# EAGLE board SmartCellPrototype (EAGLE 7.1.0), part 1 of 2
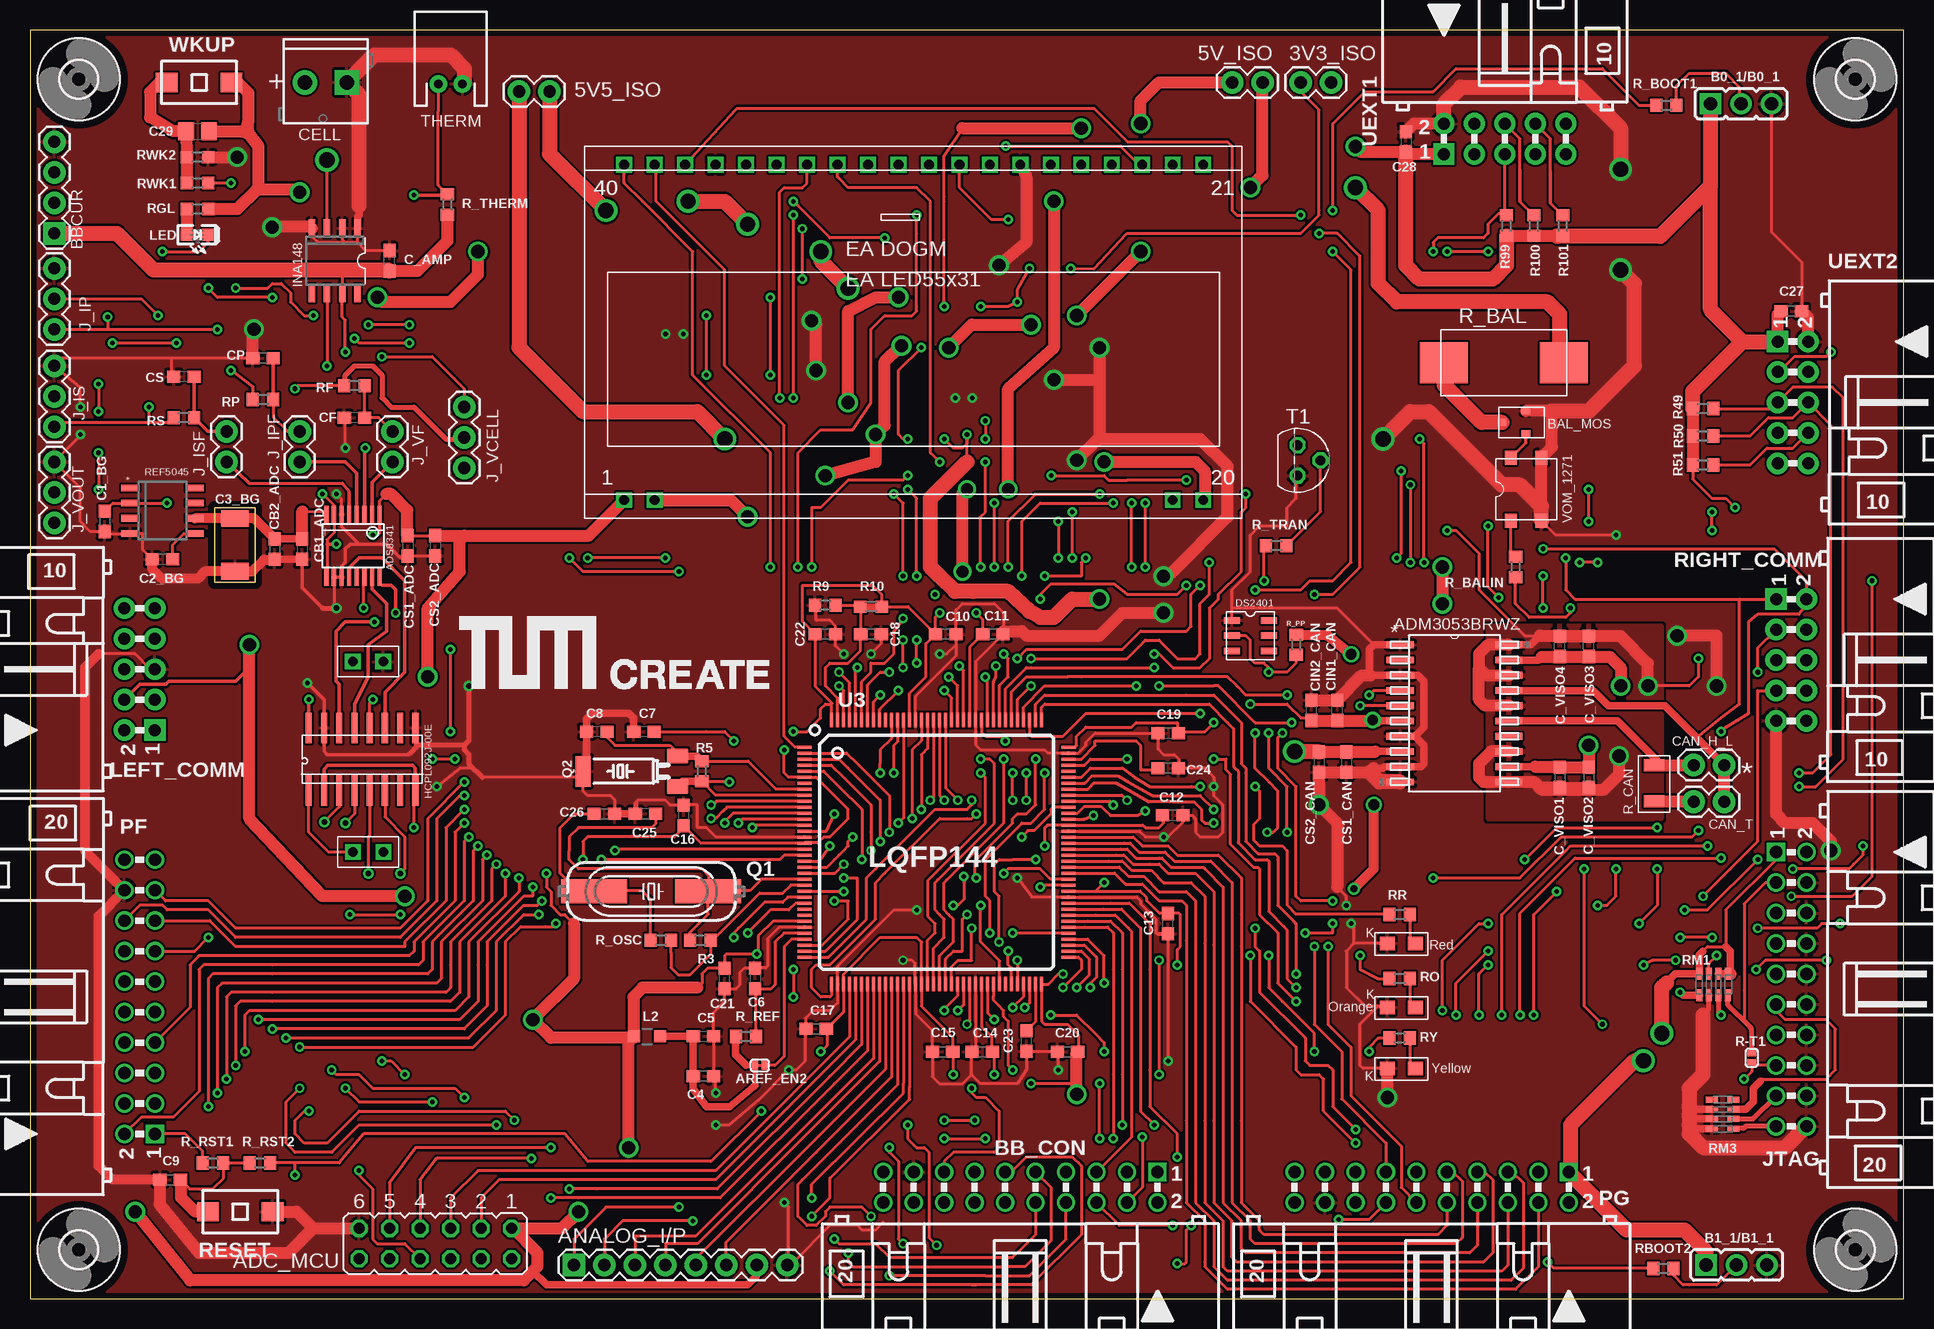
[diagram p5: board, top side]
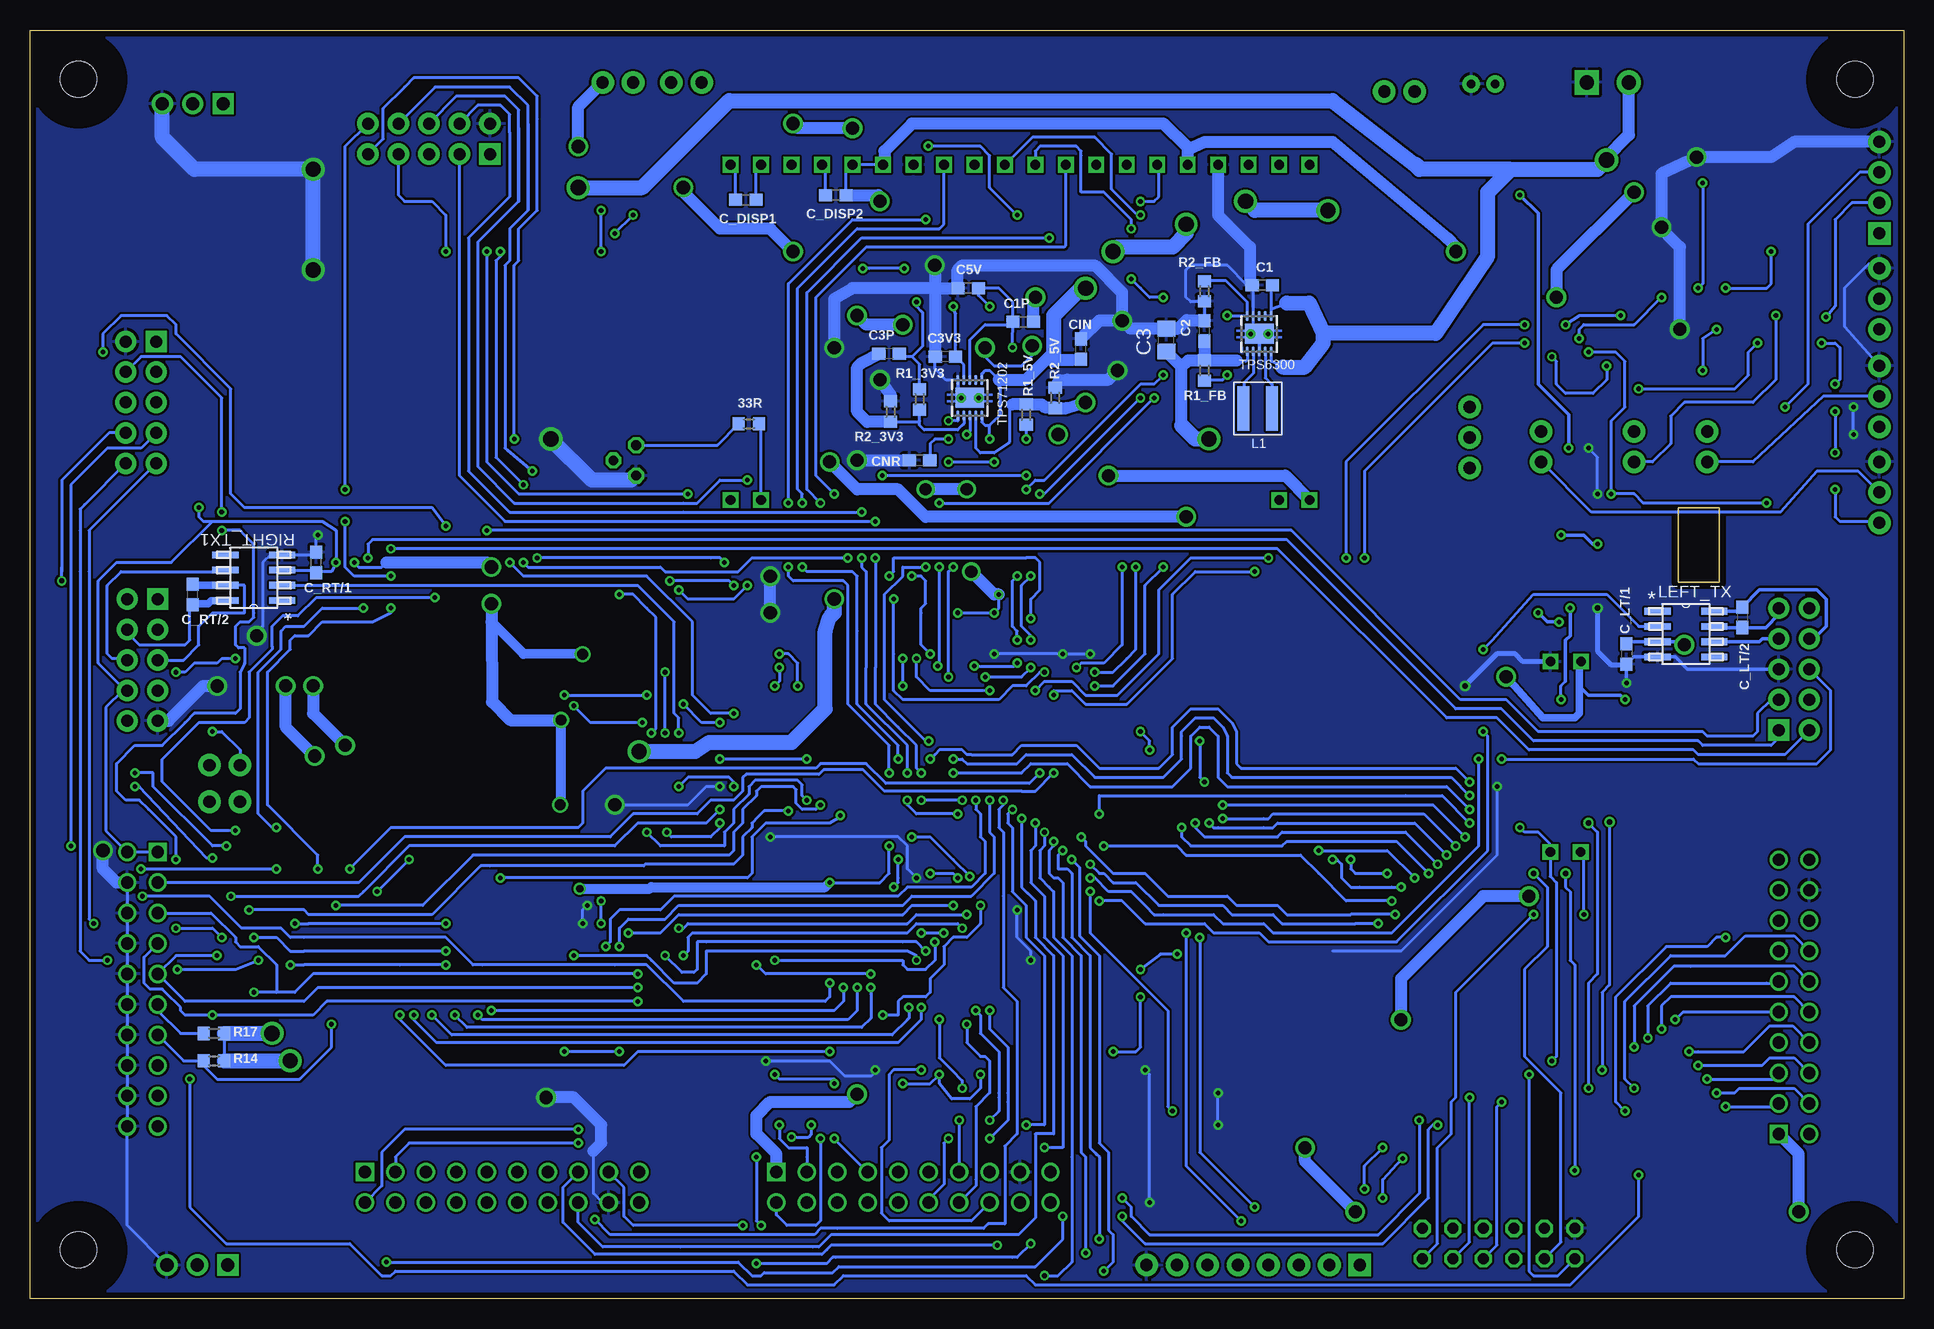
[diagram p6: board, bottom side, seen from below]

Size 156.19 x 105.72 mm. Coordinates in mm from the lower left corner, seen from the top.
Outline: 0,0 156.19,0 156.19,105.72 0,105.72 0,0
Copper layers (1*16): Top 0.0356mm / dielectric 1.5011mm / Bottom 0.0356mm
Design rules "SilverCircuits": minimum track width 7mil, minimum drill 14mil, track to track 7mil, track to pad 7mil, pad to pad 7mil, via to via 7mil, smd to smd 0mil, copper to edge 20mil, drill to drill 8mil, minimum pad ring 10mil, minimum via ring 8mil, stop-mask expansion 4mil, vias tented up to drill 0mil, thermal gap 10mil
Net classes: 2 thin: width 0.025 mm, clearance 0.025 mm

## Footprints (pad centres in the part's own frame; a part is rotated, then mirrored left to right if it is on the bottom)
1X02 = drill 1.016 pad 1.88: 1 0,0; 2 2.54,0
JP6Q = drill 0.914 octagon: 1 -6.35,-1.27; 2 -6.35,1.27; 3 -3.81,-1.27; 4 -3.81,1.27; 5 -1.27,-1.27; 6 -1.27,1.27; 7 1.27,-1.27; 8 1.27,1.27; 9 3.81,-1.27; 10 3.81,1.27; 11 6.35,-1.27; 12 6.35,1.27
1X08 = drill 1.016 pad 1.88 square: 1 0,0 | drill 1.016 pad 1.88: 2 2.54,0; 3 5.08,0; 4 7.62,0; 5 10.16,0; 6 12.7,0; 7 15.24,0; 8 17.78,0
SJ_1_SMALLER_CLOSE = smd 0.508 x 0.762: 1 -0.381,0; 2 0.381,0
JP2 = drill 1.1 pad 1.778 square: 1 -2.54,0 | drill 1.1 pad 1.778: 2 0,0; 3 2.54,0
BAL_MOS = smd 0.56 x 0.73: D 0,0.99; G -0.95,-0.99; S 0.95,-0.99
BH20R = drill 1.016 square: 1 -11.43,-1.27 | drill 1.016: 2 -11.43,1.27; 3 -8.89,-1.27; 4 -8.89,1.27; 5 -6.35,-1.27; 6 -6.35,1.27; 7 -3.81,-1.27; 8 -3.81,1.27; 9 -1.27,-1.27; 10 -1.27,1.27; 11 1.27,-1.27; 12 1.27,1.27; 13 3.81,-1.27; 14 3.81,1.27; 15 6.35,-1.27; 16 6.35,1.27; 17 8.89,-1.27; 18 8.89,1.27; 19 11.43,-1.27; 20 11.43,1.27
1X04 = drill 1.016 pad 1.88 square: 1 0,0 | drill 1.016 pad 1.88: 2 2.54,0; 3 5.08,0; 4 7.62,0
C0603 = smd 1.1 x 1: 1 -0.85,0; 2 0.85,0
C0805 = smd 1.3 x 1.5: 1 -0.95,0; 2 0.95,0
C3_BG = smd 1.4 x 2.3: + -2.2,0; - 2.2,0
SCREWTERMINAL-3.5MM-2 = drill 1.2 pad 2.032 square: 1 0,0 | drill 1.2 pad 2.032: 2 3.5,0
DS2401 = smd 1.33 x 0.53: DATA -1.525,0; GND -1.525,1.27; NC1 -1.525,-1.27; NC2 1.525,-1.27; NC3 1.525,0; NC4 1.525,1.27
3,0 = hole 3: 0,0
HCPL902 = smd 0.508 x 2.54: G1 3.18,2.6; G2 3.18,-2.6; G11 -4.44,2.6; G22 -4.44,-2.6; IN1 1.91,2.6; IN2 0.63,2.6; IN3 -0.64,2.6; IN4 -1.9,-2.6; N1 -3.17,2.6; N2 -3.17,-2.6; OUT1 1.91,-2.6; OUT2 0.63,-2.6; OUT3 -0.64,-2.6; OUT4 -1.9,2.6; V1 4.45,2.6; V2 4.45,-2.6
DRC-S-PVSON-N10 = smd 0.28 x 0.85: 1 -1,-1.475; 2 -0.5,-1.475; 3 0,-1.475; 4 0.5,-1.475; 5 1,-1.475; 6 1,1.475; 7 0.5,1.475; 8 0,1.475; 9 -0.5,1.475; 10 -1,1.475 | smd 2.4 x 1.65: TH 0,0
INA148 = smd 0.55 x 1.5: +IN 0.635,-2.7; -IN -0.635,-2.7; NC -1.905,2.7; NC1 1.905,2.7; REF -1.905,-2.7; V+ -0.635,2.7; V- 1.905,-2.7; VOUT 0.635,2.7
1X03 = drill 1.016 pad 1.88: 1 0,0; 2 2.54,0; 3 5.08,0
IND_COILCRAFT3.3UH = smd 1 x 3.7: L1 -1.19,0; L2 1.19,0
FERRITE_BEAD = smd 1 x 1: 1 -1.1,0; 2 1.1,0
EA_EA_DOGM = drill 0.813 square: 1 0,0; 2 2.54,0; 19 45.72,0; 20 48.26,0; 21 48.26,27.94; 22 45.72,27.94; 23 43.18,27.94; 24 40.64,27.94; 25 38.1,27.94; 26 35.56,27.94; 27 33.02,27.94; 28 30.48,27.94; 29 27.94,27.94; 30 25.4,27.94; 31 22.86,27.94; 32 20.32,27.94; 33 17.78,27.94; 34 15.24,27.94; 35 12.7,27.94; 36 10.16,27.94; 37 7.62,27.94; 38 5.08,27.94; 39 2.54,27.94; 40 0,27.94
LED-0603 = smd 1.016 x 1.016: A 0.889,0; C -0.889,0
EA_EA_LED55X31 = drill 0.813 square: 1 0,0; 2 2.54,0; 19 45.72,0; 20 48.26,0; 21 48.26,27.94; 22 45.72,27.94; 23 43.18,27.94; 24 40.64,27.94; 25 38.1,27.94; 26 35.56,27.94; 27 33.02,27.94; 28 30.48,27.94; 29 27.94,27.94; 30 25.4,27.94; 31 22.86,27.94; 32 20.32,27.94; 33 17.78,27.94; 34 15.24,27.94; 35 12.7,27.94; 36 10.16,27.94; 37 7.62,27.94; 38 5.08,27.94; 39 2.54,27.94; 40 0,27.94
BH10R = drill 1 pad 1.778 square: 1 -5.08,-1.27 | drill 1 pad 1.778: 2 -5.08,1.27; 3 -2.54,-1.27; 4 -2.54,1.27; 5 0,-1.27; 6 0,1.27; 7 2.54,-1.27; 8 2.54,1.27; 9 5.08,-1.27; 10 5.08,1.27
R_8 = smd 2.184 x 0.559: 1 -2.362,1.905; 2 -2.362,0.635; 3 -2.362,-0.635; 4 -2.362,-1.905; 5 2.362,-1.905; 6 2.362,-0.635; 7 2.362,0.635; 8 2.362,1.905
HC49/SMD2 = smd 5.5 x 2: 1 -4.75,0; 2 4.75,0
TC26H_3_REPAIR_SMD = smd 1.27 x 1.778: 1 -1.27,0; 2 1.27,0 | smd 2.54 x 1.27: GND 0,7.874
R0603 = smd 1 x 1.1: 1 -0.85,0; 2 0.85,0
0603_0R = smd 1.016 x 1.016: 1 -0.889,0; 2 0.889,0
SJ_1_SMALLER = smd 0.508 x 0.762: 1 -0.381,0; 2 0.381,0
R_BAL = smd 4 x 3.4: 1 -5,0; 2 5,0
120OHM = smd 1 x 1.7: 1 -1.5,0; 2 1.5,0
WS-TAKT_6X3.5_SMD_NOCREAM = smd 1.6 x 1.8: P$1 0,2.7; P$2 0,-2.7
R0603_5MIL_DWS = smd 1.016 x 1.016: 1 -0.889,0; 2 0.889,0
R_MATRIX_4 = smd 1 x 0.5: 1.1 -0.9,1.2; 1.2 0.9,1.2; 2.1 -0.9,0.4; 2.2 0.9,0.4; 3.1 -0.9,-0.4; 3.2 0.9,-0.4; 4.1 -0.9,-1.2; 4.2 0.9,-1.2
TRANSISTOR-NPN_TO92 = drill 0.813 octagon: 1 1.27,0; 2 0,1.905; 3 -1.27,0
JST-2-PTH = drill 0.7 pad 1.448: 1 -1,0; 2 1,0
RW_20 = smd 2.286 x 0.559: 1 -4.528,5.715; 2 -4.528,4.445; 3 -4.528,3.175; 4 -4.528,1.905; 5 -4.528,0.635; 6 -4.528,-0.635; 7 -4.528,-1.905; 8 -4.528,-3.175; 9 -4.528,-4.445; 10 -4.528,-5.715; 11 4.528,-5.715; 12 4.528,-4.445; 13 4.528,-3.175; 14 4.528,-1.905; 15 4.528,-0.635; 16 4.528,0.635; 17 4.528,1.905; 18 4.528,3.175; 19 4.528,4.445; 20 4.528,5.715
LQFP144 = smd 1.2 x 0.254: 1 -11,8.75; 2 -11,8.25; 3 -11,7.75; 4 -11,7.25; 5 -11,6.75; 6 -11,6.25; 7 -11,5.75; 8 -11,5.25; 9 -11,4.75; 10 -11,4.25; 11 -11,3.75; 12 -11,3.25; 13 -11,2.75; 14 -11,2.25; 15 -11,1.75; 16 -11,1.25; 17 -11,0.75; 18 -11,0.25; 19 -11,-0.25; 20 -11,-0.75; 21 -11,-1.25; 22 -11,-1.75; 23 -11,-2.25; 24 -11,-2.75; 25 -11,-3.25; 26 -11,-3.75; 27 -11,-4.25; 28 -11,-4.75; 29 -11,-5.25; 30 -11,-5.75; 31 -11,-6.25; 32 -11,-6.75; 33 -11,-7.25; 34 -11,-7.75; 35 -11,-8.25; 36 -11,-8.75; 73 11,-8.75; 74 11,-8.25; 75 11,-7.75; 76 11,-7.25; 77 11,-6.75; 78 11,-6.25; 79 11,-5.75; 80 11,-5.25; 81 11,-4.75; 82 11,-4.25; 83 11,-3.75; 84 11,-3.25; 85 11,-2.75; 86 11,-2.25; 87 11,-1.75; 88 11,-1.25; 89 11,-0.75; 90 11,-0.25; 91 11,0.25; 92 11,0.75; 93 11,1.25; 94 11,1.75; 95 11,2.25; 96 11,2.75; 97 11,3.25; 98 11,3.75; 99 11,4.25; 100 11,4.75; 101 11,5.25; 102 11,5.75; 103 11,6.25; 104 11,6.75; 105 11,7.25; 106 11,7.75; 107 11,8.25; 108 11,8.75 | smd 0.254 x 1.2: 37 -8.75,-11; 38 -8.25,-11; 39 -7.75,-11; 40 -7.25,-11; 41 -6.75,-11; 42 -6.25,-11; 43 -5.75,-11; 44 -5.25,-11; 45 -4.75,-11; 46 -4.25,-11; 47 -3.75,-11; 48 -3.25,-11; 49 -2.75,-11; 50 -2.25,-11; 51 -1.75,-11; 52 -1.25,-11; 53 -0.75,-11; 54 -0.25,-11; 55 0.25,-11; 56 0.75,-11; 57 1.25,-11; 58 1.75,-11; 59 2.25,-11; 60 2.75,-11; 61 3.25,-11; 62 3.75,-11; 63 4.25,-11; 64 4.75,-11; 65 5.25,-11; 66 5.75,-11; 67 6.25,-11; 68 6.75,-11; 69 7.25,-11; 70 7.75,-11; 71 8.25,-11; 72 8.75,-11; 109 8.75,11; 110 8.25,11; 111 7.75,11; 112 7.25,11; 113 6.75,11; 114 6.25,11; 115 5.75,11; 116 5.25,11; 117 4.75,11; 118 4.25,11; 119 3.75,11; 120 3.25,11; 121 2.75,11; 122 2.25,11; 123 1.75,11; 124 1.25,11; 125 0.75,11; 126 0.25,11; 127 -0.25,11; 128 -0.75,11; 129 -1.25,11; 130 -1.75,11; 131 -2.25,11; 132 -2.75,11; 133 -3.25,11; 134 -3.75,11; 135 -4.25,11; 136 -4.75,11; 137 -5.25,11; 138 -5.75,11; 139 -6.25,11; 140 -6.75,11; 141 -7.25,11; 142 -7.75,11; 143 -8.25,11; 144 -8.75,11
TPS71202_LDO_ADC_MCU = smd 0.28 x 0.85: 1 -1,-1.475; 2 -0.5,-1.475; 3 0,-1.475; 4 0.5,-1.475; 5 1,-1.475; 6 1,1.475; 7 0.5,1.475; 8 0,1.475; 9 -0.5,1.475; 10 -1,1.475 | smd 2.4 x 1.65: TH 0,0
REF5045_BG = smd 0.55 x 1.5: DNC1 -1.905,-2.7; DNC8 -1.905,2.7; GND 1.905,-2.7; NC -0.635,2.7; TEMP 0.635,-2.7; TRIM/NR 1.905,2.7; VIN -0.635,-2.7; VOUT 0.635,2.7
LED_0805 = smd 1.25 x 1.1: A -1.175,0; K 1.175,0
ADS8341 = smd 0.348 x 1.397: 1 -2.223,-2.619; 2 -1.588,-2.62; 3 -0.953,-2.62; 4 -0.318,-2.62; 5 0.318,-2.62; 6 0.953,-2.62; 7 1.588,-2.62; 8 2.223,-2.62; 9 2.223,2.62; 10 1.588,2.62; 11 0.953,2.62; 12 0.318,2.62; 13 -0.318,2.62; 14 -0.953,2.62; 15 -1.588,2.62; 16 -2.223,2.62
47NF_THR_HOLE = drill 0.8 square: 1 -1.27,0; 2 1.27,0
VOM1271 = smd 1.15 x 1: 1 -2.625,1.27; 2 -2.625,-1.27; 3 2.625,-1.27; 4 2.625,1.27

## Placement (x,y rotation side)
3V3_ISO  [1X02]  105.92,101.35 0 top
5V5_ISO  [1X02]  40.77,100.58 0 top
5V_ISO  [1X02]  100.2,101.35 0 top
ADC_MCU  [JP6Q]  33.78,4.57 180 top
ANALOG_I/P  [1X08]  45.34,2.79 0 top
AREF_EN2  Close  [SJ_1_SMALLER_CLOSE]  60.83,19.43 0 top
B0_1/B0_1  HN1x3(B0_1:Open;B0_0:Close)  [JP2]  142.62,99.57 0 top
B1_1/B1_1  HN1x3(B1_1:Open;B1_0:Close)  [JP2]  142.24,2.79 0 top
BAL_MOS  [BAL_MOS]  123.7,73.03 90 top
BB_CON  BH20R  [BH20R]  82.55,9.27 180 top
BBCUR  [1X04]  2.03,88.77 90 top
C1  4.7uF  [C0603]  53.47,84.45 180 bottom
C1_BG  1uF  [C0603]  6.22,64.77 270 top
C1P  15pF  [C0603]  73.41,81.41 0 bottom
C2  3.3uF  [C0603]  58.29,80.64 90 bottom
C2_BG  1uF  [C0603]  11.05,61.59 180 top
C3  47uF  [C0805]  61.48,79.87 90 bottom
C3_BG  47uF  [C3_BG]  17.09,62.8 270 top
C3P  15pF  [C0603]  84.58,78.74 180 bottom
C3V3  2.2uF  [C0603]  79.88,78.49 180 bottom
C4  100nF  [C0603]  56.13,18.54 180 top
C5  10uF  [C0603]  56.13,21.84 0 top
C5V  2.2uF  [C0603]  77.98,84.2 180 bottom
C6  100nF  [C0603]  60.45,26.67 270 top
C7  15pF  [C0603]  51.18,47.24 180 top
C8  15pF  [C0603]  47.24,47.24 180 top
C9  100nF  [C0603]  11.68,9.91 0 top
C10  100nF  [C0603]  76.33,55.37 180 top
C11  100nF  [C0603]  80.26,55.37 180 top
C12  100nF  [C0603]  95.25,40.26 180 top
C13  100nF  [C0603]  94.87,31.24 90 top
C14  100nF  [C0603]  79.38,20.57 0 top
C15  100nF  [C0603]  76.07,20.57 0 top
C16  10uF  [C0603]  54.48,40.26 270 top
C17  10uF  [C0603]  65.53,22.48 0 top
C18  10uF  [C0603]  70.1,55.37 180 top
C19  10uF  [C0603]  94.87,47.12 0 top
C20  10uF  [C0603]  86.49,20.57 0 top
C21  100nF  [C0603]  57.91,26.67 90 top
C22  100nF  [C0603]  66.29,55.37 180 top
C23  2.2uF  [C0603]  83.06,21.46 90 top
C24  2.2uF  [C0603]  94.87,44.2 180 top
C25  27pF  [C0603]  51.31,40.39 180 top
C26  27pF  [C0603]  47.88,40.39 0 top
C27  100nF  [C0603]  146.81,82.3 180 top
C28  100nF  [C0603]  114.68,96.39 270 top
C29  100nF  [C0805]  13.97,97.28 0 top
C_AMP  0.1uF  [C0603]  29.97,86.49 90 top
C_DISP1  1uF  [C0603]  96.52,91.57 0 bottom
C_DISP2  2.2uF  [C0603]  89.03,91.95 180 bottom
C_LT/1  0.1uF  [C0603]  23.11,53.72 270 bottom
C_LT/2  0.1uF  [C0603]  13.46,56.77 270 bottom
C_RT/1  0.1uF  [C0603]  132.33,61.34 90 bottom
C_RT/2  0.1uF  [C0603]  142.62,58.67 90 bottom
C_VISO1  10uF  [C0603]  127.51,43.43 270 top
C_VISO2  100nF  [C0603]  129.92,43.43 270 top
C_VISO3  100nF  [C0603]  129.92,54.36 90 top
C_VISO4  10nF  [C0603]  127.51,54.36 90 top
CAN_H_L  [1X02]  141.22,44.45 180 top
CAN_T  [1X02]  138.68,41.4 0 top
CB1_ADC  0.1uF  [C0603]  22.68,62.45 270 top
CB2_ADC  1uF  [C0603]  20.39,62.45 270 top
CELL  [SCREWTERMINAL-3.5MM-2]  26.42,101.35 180 top
CF  [C0603]  27.05,73.41 180 top
CIN  0.1uF  [C0603]  68.58,79.12 90 bottom
CIN1_CAN  10nF  [C0603]  108.97,49.02 90 top
CIN2_CAN  100nF  [C0603]  106.81,49.02 90 top
CNR  0.01uF  [C0603]  82.04,69.85 180 bottom
CP  [C0603]  19.43,78.36 180 top
CS  [C0603]  12.83,76.83 180 top
CS1_ADC  10uF  [C0603]  31.5,62.74 270 top
CS1_CAN  10uF  [C0603]  109.73,44.7 270 top
CS2_ADC  0.1uF  [C0603]  33.78,62.74 270 top
CS2_CAN  100nF  [C0603]  107.44,44.7 270 top
DS2401  [DS2401]  101.73,55.24 0 top
H1  MOUNT-HOLE3.0  [3,0]  152.15,4.06 0 top
H2  MOUNT-HOLE3.0  [3,0]  152.15,101.6 0 top
H3  MOUNT-HOLE3.0  [3,0]  4.06,101.6 0 top
H4  MOUNT-HOLE3.0  [3,0]  4.06,4.06 0 top
HCPL092J-00E  HCPL902  [HCPL902]  27.69,44.96 180 top
IC1  TPS6300  [DRC-S-PVSON-N10]  53.72,80.39 0 bottom
INA148  [INA148]  25.4,86.49 180 top
J_IP  [1X03]  2.03,80.77 90 top
J_IPF  [1X02]  22.48,72.26 270 top
J_IS  [1X03]  2.03,72.64 90 top
J_ISF  [1X02]  16.38,72.26 270 top
J_VCELL  [1X03]  36.2,74.3 270 top
J_VF  [1X02]  30.23,72.26 270 top
J_VOUT  [1X03]  2.03,64.64 90 top
JTAG  BH20R  [BH20R]  146.81,25.78 270 top
L1  3.3uH  [IND_COILCRAFT3.3UH]  53.85,74.17 180 bottom
L2  FERRITE_BEAD  [FERRITE_BEAD]  51.44,21.84 0 top
LCD1  EA_EA_DOGM162  [EA_EA_DOGM]  49.53,66.55 0 top
LED  LED/GREEN/0603  [LED-0603]  13.97,88.65 180 top
LED1  EA_EA_LED55X31_MONO  [EA_EA_LED55X31]  49.53,66.55 0 top
LEFT_COMM  BH10R  [BH10R]  9.14,52.45 90 top
LEFT_TX  ADUM1100BR  [R_8]  18.16,55.37 0 bottom
PF  BH20R  [BH20R]  9.14,25.15 90 top
PG  BH20R  [BH20R]  116.84,9.27 180 top
Q1  [HC49/SMD2]  51.79,33.93 180 top
Q2  32768Hz/6pF  [TC26H_3_REPAIR_SMD]  53.98,43.94 90 top
R1_3V3  49.9kohm  [R0603]  82.04,74.93 90 bottom
R1_5V  93kohm  [R0603]  73.15,73.66 270 bottom
R1_FB  2Mohm  [R0603]  58.29,77.34 90 bottom
R2_3V3  30kohm  [R0603]  84.45,73.91 270 bottom
R2_5V  30kohm  [R0603]  70.74,75.06 270 bottom
R2_FB  200kohm  [R0603]  58.29,83.95 90 bottom
R3  NA  [R0603]  55.88,29.86 180 top
R5  NA  [R0603]  56.01,43.94 90 top
R9  NA  [R0603]  66.29,57.78 180 top
R10  0R(board_mounted)  [0603_0R]  70.1,57.66 0 top
R14  NA  [R0603]  140.84,19.81 0 bottom
R17  NA  [R0603]  140.84,22.1 0 bottom
R49  4.7k  [R0603]  139.45,74.17 180 top
R50  4.7k  [R0603]  139.45,71.88 180 top
R51  47k  [R0603]  139.45,69.47 180 top
R99  4.7k  [R0603]  123.06,89.41 270 top
R100  4.7k  [R0603]  125.35,89.41 270 top
R101  47k  [R0603]  127.76,89.41 270 top
R-T1  Open  [SJ_1_SMALLER]  143.51,20.07 270 top
R_BAL  33R  [R_BAL]  122.84,77.98 180 top
R_BALIN  190R  [R0603]  123.83,60.96 90 top
R_BOOT1  4.7k  [R0603]  136.4,99.44 0 top
R_CAN  120OHMS  [120OHM]  135.38,42.93 270 top
R_DISP  33R  [R0603]  96.27,72.9 0 bottom
R_OSC  150R  [R0603]  52.58,29.86 0 top
R_PP  3.3k  [R0603]  105.54,54.48 270 top
R_REF  22R  [R0603]  59.69,21.84 0 top
R_RST1  10k  [R0603]  15.24,11.3 180 top
R_RST2  1k  [R0603]  19.18,11.3 180 top
R_THERM  100k  [R0603]  34.8,91.19 270 top
R_TRAN  220R  [R0603]  103.89,62.74 180 top
RBOOT2  4.7k  [R0603]  136.14,2.51 0 top
RESET  SW-TAKTT1107A(6X3,8X2,5MM)  [WS-TAKT_6X3.5_SMD_NOCREAM]  17.53,7.24 90 top
RF  [R0603]  27.05,76.07 0 top
RGL  65R  [R0603_5MIL_DWS]  13.97,90.81 0 top
RIGHT_COMM  BH10R  [BH10R]  146.81,53.21 270 top
RIGHT_TX1  ADUM1100BR  [R_8]  137.54,60.07 180 bottom
RM1  NA(10k)  [R_MATRIX_4]  140.34,26.16 90 top
RM3  RA1206_(4X0603)_4B8_10k  [R_MATRIX_4]  141.1,15.37 180 top
RO  55R  [R0603]  114.17,26.67 180 top
RP  [R0603]  19.43,74.93 0 top
RR  55R  [R0603]  114.17,32 180 top
RS  [R0603]  12.83,73.41 0 top
RWK1  1k  [R0603_5MIL_DWS]  13.97,92.96 0 top
RWK2  47k  [R0603_5MIL_DWS]  13.97,95.12 180 top
RY  60R  [R0603]  114.17,21.72 180 top
T1  TRANSISTOR-NPN_BC547  [TRANSISTOR-NPN_TO92]  105.66,69.85 270 top
THERM  [JST-2-PTH]  35.05,101.22 0 top
U1  ADM3053BRWZ  [RW_20]  118.75,48.77 0 top
U3  STM32F407ZET6  [LQFP144]  75.56,37.21 0 top
U$1  TPS71202  [TPS71202_LDO_ADC_MCU]  77.85,75.06 180 bottom
U$2  REF5045  [REF5045_BG]  11.05,65.66 270 top
U$3  Yellow  [LED_0805]  114.3,19.18 180 top
U$4  Red  [LED_0805]  114.3,29.59 180 top
U$5  Orange  [LED_0805]  114.3,24.26 180 top
U$6  [BIGGER_LOGO]  35.05,50.09 0 top
U$8  ADS8341  [ADS8341]  26.92,62.74 180 top
U$13  47NF_THR_HOLE  [47NF_THR_HOLE]  28.17,53.08 0 top
U$14  47NF_THR_HOLE  [47NF_THR_HOLE]  28.19,37.21 0 top
UEXT1  BH10R  [BH10R]  122.94,96.65 0 top
UEXT2  BH10R  [BH10R]  146.94,74.68 270 top
VOM_1271  [VOM1271]  124.71,67.44 90 top
WKUP  SW-TAKTT1107A(6X3,8X2,5MM)  [WS-TAKT_6X3.5_SMD_NOCREAM]  14.1,101.35 270 top

## Tracks (layer width: path | path; a pad name or v marks a point on that pad's centre or on a via)
3V3  (via drill 0.38, 0.6, 0.9, 1.02, 1.09, 1.1, 1.27)
  Top 0.254: U3.30 61.94,31.46 60.71,30.23 60.71,28.83 v60.58,28.7 58.04,28.7 57.91,28.57 C21.2 56.48,27.52 56.01,27.05 56.01,26.29 55.63,25.91 | U3.144 66.81,49.53 | 66.81,49.53 66.81,49.64 65.44,51.02 C22.2 64.39,56.43 64.39,59.44 70.23,59.44 70.99,58.67 R10.2 73.19,57.66 C10.2 | 75.35,55.24 C10.2 | U3.121 78.31,54.27 C11.2 79.41,56.6 v78.87,57.15 | U3.62 79.31,22.67 80.14,21.84 80.14,20.66 C14.2 80.39,20.41 v80.39,18.67 | U3.52 74.31,24.36 76.92,21.76 C15.2 76.92,18.71 v76.96,18.67 | 87.38,20.61 87.38,21.97 86.49,22.86 84.58,22.86 84.31,23.13 U3.72 84.89,26.21 85.72,27.05 v86.11,27.05 | 87.38,20.61 C20.2 | C10.2 75.48,56.81 v75.82,57.15 | U3.39 67.81,23.91 C17.2 | 87.38,20.61 87.38,18.41 86.87,17.91 v83.44,17.91 | 139.06,28.57 139.45,28.96 139.83,29.34 141.35,29.34 141.35,32.38 145.54,36.58 JTAG.1 | R_RST1.2 14.39,12.28 12.95,13.72 PF.1 | 88.83,33.96 92.53,33.96 93.09,33.4 93.09,33.15 94.15,32.09 C13.2 94.91,32.13 95.76,32.13 95.89,32 95.89,29.34 95.63,29.08 v95.63,27.81 | U3.131 73.31,50.45 74.68,51.82 74.68,54.57 C10.2 | 127.98,88.77 R101.2 | v62.87,45.72 62.87,43.81 63.22,43.46 U3.6 65.5,43.46 68.2,40.77 68.2,40.01 66.67,38.48 66.17,38.48 65.66,37.97 64.58,37.97 U3.17 55.93,37.96 C16.2 54.48,39.24 53.72,38.48 46.48,38.48 46.1,38.1 v46.1,36.58 | v63.63,47.24 64.77,47.24 65.91,48.39 65.91,49.15 66.29,49.53 66.81,49.53 | U3.39 67.81,23.87 66.42,22.48 66.42,21.08 v65.91,20.57 | v63.63,27.43 v63.63,25.15 | U3.39 67.81,27.05 70.87,30.1 73.91,30.1 74.31,29.7 U3.52 | U3.52 74.31,24.79 74.3,24.77 74.3,24.38 | U3.84 88.83,33.96 | 88.83,33.96 v89.53,34.67 | v84.58,37.72 84.58,39.24 84.8,39.46 U3.95 92.75,39.46 92.96,39.24 94.11,39.24 94.49,39.62 94.49,40.17 C12.2
  Top 0.254: 95.63,47.24 95.63,47.2 C19.2 | 110.7,48.17 CIN2_CAN.1 106.59,48.39 105.92,48.39 104.78,49.53 v101.73,49.53 | 95.63,47.24 95.63,48.01 92.2,48.01 91.82,47.62 88.01,47.62 87.25,46.86 87.25,46.1 87.11,45.96 U3.108 | 95.63,47.24 97.92,47.24 v98.68,48.01 | R51.2 138.6,68.29 140.21,66.67 141.35,66.67 v142.11,65.91 | v130.68,61.34 v129.16,61.34 | v43.05,35.43 43.05,34.29 43.43,33.91 43.43,32.77 44.2,32 44.58,32 45.34,31.24
  Top 0.305: v18.29,54.48 18.29,52.58 17.14,51.44 11.56,51.44 11.3,51.18 9.14,51.18 LEFT_COMM.4
  Top 0.61: 112.27,48.13 U1.6 | ANALOG_I/P.7 60.58,1.91 59.82,1.14 43.05,1.14 41.91,2.29 | RM1.3.2 RM1.4.2 | 141.73,27.05 141.73,28.96 141.35,29.34 | 139.45,28.96 139.13,28.64 RM1.1.2 137.93,27.06 137.92,27.05 137.16,27.05 136.21,26.1
  Top 0.813: v110.36,34.16 112.01,35.81 v112.01,41.15 | R_PP.1 108.12,55.33 v110.12,53.69
  Top 1.016: C29.2 17.65,97.28 18.22,97.09 | 18.22,97.09 18.16,98.04 18.19,98.07 18.19,100.47 17.31,101.35 WKUP.P$1 | RGL.2 17.27,90.81 18.92,92.46 | CIN2_CAN.1 CIN1_CAN.1 111.95,48.17 | 112.27,48.13 112.23,48.17 111.95,48.17 | R99.2 R100.2 127.25,88.56 R101.2 | R49.2 R50.2 R51.2 | UEXT2.1 145.67,82 C27.2 | v85.34,91.44 85.34,79.25 81.53,75.82 v81.53,67.44 | 18.92,92.46 19.05,92.58 19.05,96.01 18.22,97.09 | 50.29,21.89 50.29,25.15 51.05,25.91 55.63,25.91 | 50.29,21.89 L2.1 49.91,21.42 v49.91,12.57 | v45.72,7.24 44.32,5.84 ADC_MCU.1 40.26,5.84 42.29,3.81 42.29,2.67 41.91,2.29 41.15,1.52 13.34,1.52 v8.76,7.24 | v77.72,60.58 77.72,67.06 v78.11,67.44 | v117.73,60.96 v117.73,57.91 | v87.25,17.02 87.25,20.49 C20.2 | 18.92,92.46 22.23,92.46 v22.48,92.2 | v28.96,83.44 29.34,83.06 35.05,83.06 37.34,85.34 v37.34,87.25 | 50.29,21.89 50.29,21.72 43.43,21.72 v41.91,23.24 45.34,26.67 45.34,31.24 | v31.24,33.53 24.38,33.53 18.29,40.01 v18.29,54.48 | UEXT1.1 114.85,95.38 C28.2 110.96,95.54 v110.49,96.01 | 111.95,48.17 v111.91,48.21 | RM1.4.2 141.73,27.06 141.73,27.05
  Top 1.27: R49.2 138.6,75.6 142.75,79.76 | 142.75,79.76 UEXT2.1 | R99.2 123.06,86.11 121.92,84.96 115.82,84.96 114.68,86.11 C28.2 | 142.75,79.76 140.08,82.42 140.08,92.71 | B0_1/B0_1.1 140.08,92.71 | 140.08,92.71 135.89,88.52 127.29,88.52 127.25,88.56 | v134.49,19.81 133.73,19.81 128.4,14.48 128.4,10.67 PG.1 133.1,5.71 137.92,5.71 139.7,3.94 B1_1/B1_1.1 | v136.02,22.1 136.02,25.91 136.21,26.1 136.4,26.29
  Bottom 0.254: RIGHT_TX1.3 132.55,60.71 C_RT/1.1 132.25,60.58 131.06,60.58 v130.68,61.34 130.68,64.01 131.83,64.77 140.97,64.77 | v83.44,17.91 81.15,17.91 v80.39,18.67 80.39,17.91 79.38,16.64 77.85,16.64 76.96,17.53 v76.96,18.67 | JTAG.1 JTAG.2 149.86,38.99 149.86,49.28 148.46,50.67 RIGHT_COMM.8 148.21,50.67 150.5,52.96 150.5,59.82 148.97,61.34 144.4,61.34 140.97,64.77 | C_DISP2.1 88.18,93.94 LCD1.25 LCD1.26 | R17.2 R14.2 | v78.87,57.15 v75.82,57.15 75.44,57.53 v75.44,58.67 | v62.87,45.72 62.87,46.48 v63.63,47.24 | v65.91,20.57 64.01,20.57 63.63,20.95 v63.63,25.15 | v60.58,28.7 61.98,28.7 v63.63,27.43 | v86.11,27.05 94.87,27.05 v95.63,27.81 | v89.53,34.67 85.34,34.67 84.58,35.43 v84.58,37.72 | v98.68,48.01 100.2,48.01 v101.73,49.53 | v142.11,65.91 142.11,65.15 141.73,64.77 140.97,64.77 | v129.16,61.34 128.78,60.96 126.87,60.96 126.49,61.34 | v46.1,36.58 46.1,35.81 45.72,35.43 v43.05,35.43
  Bottom 0.305: C_LT/1.1 22.95,54.74 LEFT_TX.3 18.54,54.74 v18.29,54.48
  Bottom 0.813: v110.36,34.16 104.52,34.16 104.39,34.29 89.92,34.29 v89.53,34.67 | v112.01,41.15 111.91,41.25 v111.91,48.21 | v110.12,53.69 115.06,53.72 117.72,56.38
  Bottom 1.016: C_DISP2.1 85.47,91.95 v85.34,91.44 | LCD1.26 84.96,94.61 84.96,95.63 82.68,97.92 61.72,97.92 59.69,95.89 LCD1.36 59.69,95.76 58.29,96.39 47.62,96.39 38.1,88.39 37.34,87.63 v37.34,87.25 | v45.72,7.24 49.91,11.43 v49.91,12.57 | v75.44,58.67 75.82,58.67 v77.72,60.58 | v78.11,67.44 v81.53,67.44 | v117.73,57.91 117.72,56.38 117.68,49.73 116.15,48.21 v111.91,48.21 | 126.49,61.34 118.11,61.34 v117.73,60.96 | BB_CON.1 93.98,12.06 95.63,13.72 95.63,15.24 94.49,16.38 87.88,16.38 v87.25,17.02 | v8.76,7.24 8.76,12.06 PF.1 | v22.48,92.2 28.96,85.72 v28.96,83.44 | v110.49,96.01 110.49,99.31 3V3_ISO.2 | v31.24,33.53 35.05,33.53 41.91,26.67 v41.91,23.24
  Bottom 1.27: R14.2 v134.49,19.81 | R17.2 v136.02,22.1
3V3_OUT  (via drill 0.38)
  Top 0.254: v83.31,85.85 82.3,84.07 v82.3,83.06 81.53,82.68 v79.25,82.68 | v86.77,85.85 88.7,85.84 91.44,88.77 105.92,88.77 107.44,90.3 107.44,90.68 107.44,99.06 105.92,100.58 3V3_ISO.1
  Bottom 0.254: U$1.4 78.35,77.8 C3V3.1 79.03,79.46 79.03,82.08 v79.25,82.68 | R1_3V3.2 82.04,77.85 82.68,78.49 | 82.68,78.49 83.48,78.49 C3P.1 | v82.3,83.06 82.3,82.68 81.92,82.3 81.79,82.17 81.79,79.38 82.68,78.49 | v83.31,85.85 86.23,85.85 v86.77,85.85
5V  (via drill 0.38, 1.09, 1.1)
  Top 0.254: C_AMP.1 26.45,85.64 26.04,85.22 INA148.V+ 26.04,81.79 26.29,81.53 v26.29,78.87 | 31.46,63.63 CS1_ADC.1 CS2_ADC.1 | U$8.9 24.77,60.18 24.77,62.87 24.77,63.25 25.34,63.82 U$8.7 25.34,66.1 v24.38,67.06 | C1_BG.1 6.9,66.29 U$2.VIN v11.43,66.29 | U$8.1 29.15,66.48 29.72,67.06
  Top 0.305: U$8.1 29.15,63.82 28.96,63.63 v28.57,63.63 | v25.53,62.87 24.77,62.87 | v23.24,49.91 HCPL092J-00E.V2
  Top 1.016: CS2_ADC.1 36.2,63.59 | 36.2,63.59 46.57,63.59 LED1.1 | 31.46,63.63 31.46,65.7 30.1,67.06 29.72,67.06 | C_AMP.1 32.3,85.64 34.8,88.14 R_THERM.2 | v66.29,68.58 70.48,69.72 v70.48,72.01 71.25,72.77 71.25,78.11 72.39,79.25 v72.65,79.39 | v33.15,51.82 33.15,57.53 35.81,60.58 35.81,63.21 36.2,63.59 | v87.25,81.92 v92.58,87.25 | v76.58,79.25 78.49,81.15 v83.44,81.15 | v101.73,92.58 102.74,93.6 5V_ISO.2
  Top 1.27: BBCUR.1 7.24,88.77 10.29,85.72 29.88,85.72 C_AMP.1
  Bottom 0.254: v11.43,66.29 21.72,66.29 22.48,67.06 v24.38,67.06 24.38,73.15 23.24,74.3 23.24,78.11 24,78.87 v26.29,78.87 | v72.65,79.39 72.39,78.87 73.53,77.72 75.82,77.72 76.58,78.49 v76.58,79.25
  Bottom 0.305: v25.53,62.87 25.91,62.87 26.67,63.63 v28.57,63.63 | U$13.1 26.9,50.91 26.29,50.29 23.62,50.29 v23.24,49.91
  Bottom 0.61: v33.15,51.82 30.1,48.39 27.43,48.39 27.05,48.77 27.05,52.94 U$13.1
  Bottom 1.016: v66.29,68.58 51.56,68.58 LED1.1 | v83.44,81.15 86.49,81.15 v87.25,81.92 | v92.58,87.25 94.49,89.15 98.68,89.15 101.73,92.2 v101.73,92.58
5V5  (via drill 0.38, 1.1, 1.27)
  Top 0.254: v76.2,71.63 76.96,70.87 77.72,70.87 78.11,71.25 v78.11,72.01 78.11,69.72
  Top 0.61: 112.14,45.59 U1.8
  Top 1.016: CS2_CAN.1 CS1_CAN.1 112.1,45.55 112.14,45.59
  Top 1.27: CS2_CAN.1 105.45,45.55 v105.41,45.59 | 78.11,69.72 75.06,66.67 75.06,60.96 75.82,60.2 77.09,58.93 78.61,58.93 81.53,58.93 81.56,58.92 83.31,57.28 84.2,56.77 85.34,56.77 86.87,58.29 v89.15,58.29 | 5V5_ISO.2 43.31,95.38 v48.01,90.68 | v54.86,91.44 57.91,91.44 v59.82,89.53 | v65.91,87.25 65.91,86.49 v68.2,84.2
  Bottom 0.254: 69.56,78.49 CIN.1 | 76.85,73.04 U$1.10 76.85,73.04 | 76.85,73.04 76.58,72.77 | 76.58,72.77 76.2,72.77 | 76.2,72.77 75.82,73.15 | U$1.8 77.85,72.26 v78.11,72.01 | v76.2,71.63 76.2,72.77 | U$1.1 76.85,77.07 76.58,77.34 76.2,77.34 75.44,76.58 75.69,76.33 75.44,76.07 75.31,75.95 75.31,73.66 75.82,73.15 | 76.85,73.04 76.58,72.77 | 76.58,72.77 76.2,72.77 | 76.2,72.77 75.82,73.15 | 75.44,73.53 75.82,73.15
  Bottom 1.016: 69.3,78.23 CIN.1 69.38,78.23 70.87,78.23 | 70.87,78.23 70.99,78.23 70.87,78.23 | 75.44,76.58 73.15,76.58 70.87,78.87
  Bottom 1.27: v105.41,45.59 100.71,45.59 99.57,46.35 92.71,46.35 92.2,46.86 89.92,49.15 89.92,55.63 89.53,56.77 89.15,57.15 v89.15,58.29 | v48.01,90.68 54.1,90.68 v54.86,91.44 | v59.82,89.53 59.82,88.77 60.96,87.63 65.53,87.63 v65.91,87.25 | v68.2,84.2 68.58,84.2 70.48,82.3 70.87,81.92 70.87,78.87 70.87,78.23
5V_OUT  (via drill 0.38, 1.1)
  Top 0.254: v76.2,82.68 76.2,83.06 76.2,91.44 76.2,91.82 76.2,95.25 77.72,97.54 | v73.15,71.63 72.77,71.63 72.39,72.01 72.39,77.34 v74.3,79.25
  Top 1.016: 77.72,97.54 v87.63,97.54 | v92.58,97.92 92.58,99.82 94.11,101.35 5V_ISO.1
  Bottom 0.254: U$1.3 77.85,79.88 76.58,81.15 74.38,81.15 C1P.1 | C1P.1 74.26,83.02 75.44,84.2 C5V.1 77.13,83.61 v76.2,82.68 | R1_5V.2 73.15,72.64 v73.15,71.63 | v74.3,79.25 74.31,79.63 C1P.1
  Bottom 1.016: v87.63,97.54 92.2,97.54 v92.58,97.92
+5V_JTAG
  Top 0.406: JTAG.19 143.01,14.35 142.85,14.19 142.02,14.19 RM3.1.1
+7V
  Top 0.254: U3.33 63.49,29.96 62.87,29.34 62.87,20.19 62.1,19.43 61.21,19.43
  Top 0.406: AREF_EN2.1 60.45,17.78
  Top 0.61: L2.2 C5.1 C4.2 55.28,17.49 56.39,16 58.29,16 60.33,17.65 60.45,17.78
AREF
  Top 0.406: 59.69,19.43 60.45,19.43
  Top 0.61: 59.69,19.43 58.8,20.32 58.8,21.8 R_REF.1
BG_OUT
  Top 0.254: 22.19,63.25 CB1_ADC.1 | 22.71,65.59 24.49,65.57 U$8.8
  Top 0.305: 22.71,63.39 CB1_ADC.1
  Top 0.61: CB2_ADC.1 CB1_ADC.1
  Top 0.813: C3_BG.+ 16.89,65.02 16,65.02 | 16,65.02 U$2.VOUT | CB2_ADC.1 18.67,65.02 16,65.02
  Top 1.016: 22.71,63.39 22.71,65.59
BOOT0  (via drill 0.38)
  Top 0.254: U3.138 69.81,51.15 70.87,52.2 v71.63,52.2 | v84.2,58.29 84.2,58.65 84.96,59.44 85.11,59.56 88.8,59.56 90.32,59.56 91.44,58.67 95.63,58.67 v96.39,59.44 | v102.11,59.05 104.78,59.05 105.92,59.05 106.68,59.82 108.58,59.82 110.11,61.34 110.11,85.72 v108.58,87.25 | v108.58,90.68 108.58,93.73 108.58,97.92 111.25,100.58 116.97,100.58 118.87,102.49 131.06,102.49 133.35,100.2 | R_BOOT1.1 134.11,99.44 133.35,100.2 | 132.97,100.58 133.35,100.2
  Bottom 0.254: v71.63,52.2 72.01,52.2 73.15,51.05 74.3,51.05 75.44,49.91 83.44,49.91 84.2,50.67 84.2,53.72 v84.2,58.29 | v96.39,59.44 97.54,58.29 101.35,58.29 v102.11,59.05 | v108.58,87.25 v108.58,90.68
C+  (via drill 1.27, 1.3)
  Top 0.254: INA148.+IN v24.77,94.87
  Top 1.27: v110.49,92.58 112.39,90.68 112.39,84.58 113.92,83.06 126.49,83.06 127.49,82.06 127.49,78.49 127,78 127.82,78 R_BAL.1
  Bottom 0.254: IC1.6 52.72,84.35 C1.1 | IC1.6 IC1.7 IC1.8 | IC1.6 52.71,82.5 | 51.77,77.62 52.72,78.11 IC1.5 | IC1.6 52.7,82.5 51.44,82.96
  Bottom 1.016: 24.89,95 22.92,96.97 CELL.2
  Bottom 1.27: v110.49,92.58 105.16,92.58 97.92,99.82 47.62,99.82 40.77,94.49 | v24.77,94.87 24.89,95 24.77,95.12 v24.77,94.87 | 32.77,94.11 25.53,94.11 v24.77,94.87 | 40.77,94.49 40.64,94.49 40.39,94.23 | 32.77,94.11 34.67,92.2 34.67,86.87 39.01,80.44 48.36,80.44 48.39,80.39 | 32.77,94.11 40.39,94.11 40.77,94.49 | 51.77,77.62 49.94,77.62 48.39,79.63 48.39,80.39 | 51.44,82.96 49.58,82.98 48.39,80.39
CAN_RX  (via drill 0.38)
  Top 0.254: U1.4 112.01,50.67 v111.63,50.29 | v104.78,50.29 101.35,50.29 100.58,51.05 99.82,51.82 87.63,51.82 86.49,51.82 83.06,51.82 81.81,50.57 U3.114
  Bottom 0.254: v111.63,50.29 v104.78,50.29
CAN_TX  (via drill 0.38)
  Top 0.254: U1.5 v110.87,49.4 | v93.73,52.58 83.44,52.58 83.06,52.58 81.31,50.84 U3.115 | v94.11,51.05 98.68,51.05 99.06,51.05 102.11,48.01 v105.16,48.01
  Bottom 0.254: v93.73,52.58 93.73,51.44 v94.11,51.05 | v105.16,48.01 109.47,48.01 v110.87,49.4
CANH  (via drill 0.38)
  Top 0.254: 141.35,44.58 CAN_H_L.1 139.06,46.61 | 142.49,58.29 128.78,58.29 128.02,59.05 v128.02,61.72 | 142.49,58.29 RIGHT_COMM.1 | 138.94,46.74 140.97,48.39 142.49,49.53 142.49,58.29
  Top 0.61: U1.17 130.3,50.67 131.57,49.4 136.27,49.4 138.94,46.74 CAN_H_L.1
  Top 1.016: CAN_T.2 CAN_H_L.1
  Bottom 0.254: v128.02,61.72 128.02,62.87 127.64,63.25 51.44,63.25 37.34,49.15 33.53,49.15 30.86,46.48 17.14,46.48 16.76,46.1 11.05,46.1 10.41,46.74 LEFT_COMM.1
CANL  (via drill 0.38)
  Top 0.254: v140.97,47.24 141.35,47.62 143.26,48.77 143.26,56.39 144.02,57.02 147.45,57.02 148.08,57.78 RIGHT_COMM.2 148.08,59.82 145.41,62.48 v126.11,62.48
  Top 0.61: U1.15 132.31,48.13 136.02,44.43
  Top 1.016: R_CAN.1 136.02,44.43 138.66,44.43 CAN_H_L.2
  Bottom 0.254: LEFT_COMM.2 9.91,45.34 17.14,45.34 17.53,45.72 31.24,45.72 33.91,48.39 38.1,48.39 52.2,62.48 v126.11,62.48 | v140.97,47.24 140.21,47.24 138.68,45.72 CAN_H_L.2
CS  (via drill 0.38, 0.46)
  Top 0.254: HCPL092J-00E.IN2 27.06,40.39 v26.29,39.62 | v26.29,17.53 27.43,16.38 v33.53,16.38
  Bottom 0.254: v26.29,39.62 25.53,38.86 25.53,27.05 26.29,26.29 v26.29,17.53 | ADC_MCU.6 33.91,4.45 33.91,16 v33.53,16.38
F_IP  (via drill 0.38)
  Top 0.254: 23.62,69.72 J_IPF.2 | J_IP.2 9.27,83.31 v10.67,81.92
  Top 0.305: U$8.4 27.24,68.77 26.29,69.72 J_IPF.2
  Bottom 0.254: v10.67,81.92 10.67,76.58 12.57,74.68 18.29,74.68 19.43,73.53 19.43,71.25 20.95,69.72 J_IPF.2
F_IS
  Top 0.254: 18.29,67.94 20.19,67.94 20.57,67.94 26.04,67.94 26.61,67.25 26.61,67.12
  Top 0.305: U$8.5 26.61,67.12 | 18.29,67.94 J_ISF.2
  Bottom 0.254: J_IS.2 6.73,75.18 12.57,69.72 J_ISF.2 | J_ISF.2 16.38,69.34 J_ISF.2
F_VOUT
  Top 0.305: U$8.2 28.51,68.01 J_VF.2
  Bottom 0.254: J_VF.2 26.04,65.53 10.29,65.53 7.24,68.96 3.81,68.96 J_VOUT.2
GND  (via drill 0.38, 0.38 pad 0.41, 0.46, 1.09, 1.1, 1.27, 1.3)
  Top 0.254: C_AMP.2 27.98,87.34 27.3,88.01 | 27.3,88.01 INA148.REF | INA148.-IN 26.04,88.27 26.29,88.01 | 26.29,88.01 27.3,88.01 | INA148.V- 23.5,88.52 24,88.01 26.29,88.01 | CS2_ADC.2 CS1_ADC.2 31.46,61.85 | 25.97,61.02 U$8.11 U$8.10 25.34,57.72 v25.53,57.53 | Q2.GND 46.1,43.43 | 48.77,40.77 48.77,40.42 C26.2 | C25.2 50.46,41.31 50.55,41.4 | 54.44,41.15 53.34,41.15 52.96,41.53 50.67,41.53 50.55,41.4 | 54.44,41.15 C16.1 54.52,41.15 | 54.52,41.15 55.63,41.15 55.63,39.24 56.39,39.24 57.17,38.46 U3.16 58.31,38.46 | C21.1 58.84,25.82 59.18,26.16 59.18,27.18 59.56,27.56 60.41,27.56 C6.1 60.49,27.56 61.34,27.56 61.47,27.69 61.47,29.97 62.46,30.96 U3.31 63.09,30.96 | C21.1 57.91,24.77 56.98,23.84 C5.2 C4.1 57.15,18.38 v57.15,17.14 | R9.2 65.53,57.7 65.53,56.52 66.67,56.52 67.14,56.05 C22.1 67.14,54.4 v67.82,53.72 | 77.18,54.48 C10.1 77.18,57.37 77.72,57.91 80.39,57.91 81.15,57.15 81.15,55.63 81.15,55.41 C11.1 78.81,53.07 U3.120 78.81,46.15 79.25,45.72 84.58,45.72 84.84,45.46 U3.107 87.37,45.46 88.01,46.1 88.01,46.35 88.77,47.12 C19.1 94.02,45.81 94.49,45.34 95.38,45.34 95.76,44.96 95.76,44.23 C24.1 97.92,44.2 98.68,43.43 v98.68,42.67 98.68,41.91 99.44,41.15 99.44,38.86 99.06,38.48 97.54,38.48 97.16,38.86 97.16,40.01 96.9,40.26 C12.1 96.1,39.71 94.87,38.48 v94.49,38.48 92.96,38.48 92.48,38.96 U3.94 | 77.18,54.48 77.18,53.55 73.81,50.19 U3.130 | U3.61 78.81,20.86 C14.1 78.49,20.54 78.49,18.67 | 78.49,18.67 77.72,17.91 75.82,17.91 75.22,18.5 C15.1 75.22,22.31 73.81,23.72 U3.51 73.79,26.24 73.79,27.94 73.53,28.19 v72.77,28.19 | 78.49,18.67 79.25,17.91 82.3,17.91 83.06,19.05 C23.1 85.6,20.61 C20.1 85.72,20.49 v85.72,19.05
  Top 0.254: C18.1 70.95,54.57 v70.1,53.72 | CP.2 11.81,78.36 | U$8.6 25.97,66.61 v25.53,67.06 | v26.29,70.87 26.29,73.32 | 11.81,78.36 2.29,78.36 J_IS.3 4.19,75.95 v4.19,74.3 | CS.2 11.81,77.23 11.81,78.36 | C2_BG.2 9.4,62.4 9.4,63.75 U$2.GND 6.39,63.75 C1_BG.2 5.04,63.92 4.19,64.77 4.19,67.56 J_VOUT.3 4.19,71.88 v4.19,72.01 | v75.82,53.72 76.42,53.72 77.18,54.48 | JTAG.20 146.69,12.95 141.35,12.95 | v132.21,63.63 127.17,63.63 VOM_1271.2 | 10.79,9.87 C9.1 | 23.62,5.84 22.99,5.84 | C13.1 93.94,30.39 | 93.94,30.39 93.85,30.48 93.85,31.62 92.58,32.89 92.58,33.15 92.27,33.46 U3.83 83.51,33.46 v82.3,35.05 | DS2401.GND 100.2,57.53 | T1.1 105.54,68.45 105.54,66.67 104.78,65.91 104.78,64.39 102.49,64.39 101.73,63.63 101.73,60.58 100.2,59.05 100.2,57.53 | 71.12,6.35 70.48,5.71 69.34,5.71 68.96,6.1 66.67,6.1 63.63,3.05 63.37,3.05 ANALOG_I/P.8 63.25,2.67 63.25,7.62 v62.87,8 | B0_1/B0_1.3 145.16,88.9 147.7,86.36 147.7,82.33 C27.1 | LEFT_COMM.5 10.03,52.45 8.76,53.72 5.71,53.72 | v57.15,14.48 58.29,14.48 60.77,16.57 v63.25,19.05 63.88,19.05 64.64,19.81 64.64,22.44 C17.1 64.64,22.52 64.64,23.37 65.28,24 66.67,24 67.31,24.64 U3.38 67.31,27.69 72.01,32.38 v73.91,32.38 | 93.94,30.39 93.98,30.35 94.74,30.35 94.87,30.48 v94.87,19.81 | 107.44,42.67 107.44,43.09 | 54.52,41.15 54.44,41.15 | 50.55,41.4 50.55,40.51 50.42,40.39 49.15,40.39 48.77,40.77 | 48.77,40.77 48.77,41.53 48.39,41.91 46.48,41.91 46.1,42.29 46.1,43.43 | 46.1,43.43 37.72,43.43 36.96,44.2 35.81,44.2 v33.91,42.67 | 57.82,25.91 C21.1 | 100.2,57.53 108.97,57.53 112.01,54.48 | U$3.K 111.12,19.18 110.87,19.43 110.87,22.86 112.39,24.38
  Top 0.254: 112.39,24.38 113,24.38 U$5.K | U$4.K 110.36,29.59 | 110.36,29.59 109.73,28.96 109.73,25.91 111.25,24.38 112.39,24.38 | 110.36,29.59 110.36,30.99 v110.11,31.24 | v109.73,32.77 109.73,33.53 108.97,34.29
  Top 0.305: v23.11,51.31 24.51,49.92 HCPL092J-00E.G2 24.51,45.6 24.77,45.34 31.57,45.34 31.6,45.37 32.13,45.9 HCPL092J-00E.G22 | CB1_ADC.2 22.68,59.24 24.38,57.53 | U$8.6 25.97,64.33 27.43,62.87 | CS1_ADC.2 31.33,61.72 30.86,61.72 29.72,62.87 27.43,62.87 | 27.43,62.87 26.67,62.87 26.29,62.48 26.29,61.34 25.97,61.02
  Top 0.406: 139.45,23.62 139.94,24.11 RM1.2.1 | v36.58,51.05 36.58,46.48 36.2,46.1 | 36.2,46.1 32.33,46.1 31.6,45.37 | 36.2,46.1 36.2,45.72 36.58,45.34 36.58,44.58 37.72,43.43 | 24.38,57.53 v25.53,57.53
  Top 0.61: CB2_ADC.2 CB1_ADC.2 | Q2.GND 46.39,44.23 C8.2 46.39,48.3 46.86,48.77 49.91,48.77 50.29,48.39 50.29,47.28 C7.2 | C26.2 50.42,40.39 C25.2 | 111.76,51.94 U1.3 115.7,51.94 116.2,51.44 116.2,47.62 115.44,46.86 | 112.01,44.2 112.78,44.2 112.9,44.32 U1.9 115.95,44.32 116.2,44.58 116.2,46.1 115.44,46.86 | 27.43,91.06 27.43,90.3 27.3,90.17 INA148.REF | U1.1 112.01,54.48 111.63,54.1 111.63,51.94 | U1.7 115.44,46.86 | RM3.3.2 138.3,15.77 138.3,16 | RM3.2.2 138.3,14.97 138.3,15.24 | RM3.1.2 138.3,14.17 138.3,14.48
  Top 0.813: C9.1 6.86,9.91 5.71,11.05 5.71,31.88 PF.18 4.57,37.34 4.57,52.58 5.71,53.72 | CB2_ADC.2 20.36,61.58 19.51,61.58 18.53,60.6 C3_BG.- 14.6,60.6 14,60 10.99,60 10.2,60.79 C2_BG.2
  Top 1.016: v85.34,76.58 89.15,76.58 | 89.15,76.58 89.15,71.75 89.03,71.63 | v89.15,79.25 89.15,76.58 | v65.53,77.34 65.53,81.11 v65.15,81.5 | RWK2.1 v17.27,95.12 | INA148.V- 23.37,89.31 20.23,89.31 v20.19,89.28 | CP.2 18.58,80.68 v18.67,80.77 | VOM_1271.2 VOM_1271.3 126.87,70.95 126.87,73.91 126.81,73.97 BAL_MOS.S | CIN2_CAN.2 CIN1_CAN.2 111.04,51.94 111.63,51.94 111.76,51.94 | 112.01,44.2 111.67,43.85 CS1_CAN.2 CS2_CAN.2 107.44,43.09 v107.44,41.15 108.97,39.62 108.97,34.29 | UEXT2.2 148.21,81.75 C27.1 | LCD1.27 83.06,93.47 83.06,88.01 v80.77,86.11 | v113.16,16.76 113.16,19.14 U$3.K | v150.11,37.34 150.11,38.1 148.59,39.62 146.3,39.62 145.54,40.39 RIGHT_COMM.9 | v140.59,51.05 140.59,55.24 v137.29,55.24 | 81.15,55.63 82.68,55.63 83.06,55.24 89.15,55.24 91.06,57.15 v94.49,57.15 | v94.49,60.2 95.25,60.58 99.82,65.15 99.82,69.34 97.54,71.63 89.03,71.63 | 89.03,71.63 v87.25,69.85 | UEXT1.2 115.36,97.92 C28.1 | RESET.P$2 22.23,7.24 23.62,5.84 | 10.79,9.87 10.79,7.87 14.1,3.81 21.59,3.81 23.62,5.84 | 23.62,5.84 ADC_MCU.11
  Top 1.27: 126.81,73.97 129.98,73.97 133.73,77.72 133.73,84.58 v132.59,85.72 | 139.45,23.62 139.45,18.67 138.3,17.53 138.3,16 138.3,15.24 138.3,14.48 138.3,13.72 139.45,12.57 146.3,12.57 JTAG.20 | VOM_1271.2 125.98,66.04 124.21,67.82 122.68,67.82 116.59,73.91 115.06,73.91 v112.78,71.63 | U1.10 112.47,43.05 111.67,43.85 | THERM.2 36.2,101.36 36.2,102.49 35.05,103.63 28.7,103.63 CELL.1 27.43,100.33 27.43,91.06 | UEXT1.2 117.86,99.57 119.25,100.97 129.16,100.97 132.59,97.54 v132.59,94.11
  Bottom 0.254: v67.82,53.72 v70.1,53.72 v75.82,53.72 | C2.2 R2_FB.1 58.33,83.06 59.44,83.06 59.82,83.44 59.82,85.72 59.44,86.11 56.39,86.11 54.74,84.45 C1.2 54.22,84.36 IC1.9 54.23,81.86 54.23,80.64 53.72,80.14 IC1.3 | U$1.5 79.83,76.53 80.77,77.47 80.77,78.45 C3V3.2 | v25.53,67.06 25.53,70.1 v26.29,70.87 | B1_1/B1_1.3 148.08,6.1 JTAG.20 JTAG.18 JTAG.16 JTAG.14 JTAG.12 JTAG.10 JTAG.8 JTAG.6 JTAG.4 | v132.21,63.63 132.33,63.5 C_RT/1.2 132.55,61.98 RIGHT_TX1.4 136.14,61.98 136.78,61.34 136.78,56.01 v137.29,55.24 | v57.15,14.48 v57.15,17.14 | v72.77,28.19 72.77,28.96 73.91,30.1 v73.91,32.38 | v94.87,19.81 89.53,19.81 88.27,18.54 86.08,18.54 85.72,18.9 v85.72,19.05 | v94.49,38.48 83.82,38.48 83.06,37.72 83.06,35.81 v82.3,35.05 | v98.68,42.67 99.82,42.67 101.35,41.15 v107.44,41.15 | v33.91,42.67 33.91,36.96 41.91,28.96 47.62,28.96 | v110.11,31.24 110.11,32.38 v109.73,32.77 | PG.18 108.46,8 109.22,8.76 109.22,12.32 | v4.19,72.01 v4.19,74.3 | J_IP.3 2.92,86.23 4.95,84.2 4.95,81.03 J_IS.3 | v62.87,8 62.87,18.67 v63.25,19.05 | 106.05,68.2 T1.1
  Bottom 0.305: 23.33,53.09 C_LT/1.2 | v23.11,51.31 C_LT/1.2 | C_LT/1.2 22.52,53.47 LEFT_TX.4 19.05,53.47 18.03,52.45 LEFT_COMM.5 | IC1.TH IC1.3 | 78.85,75.06 U$1.5
  Bottom 0.406: U$1.TH v78.55,75.06 78.85,75.06 | U$13.2 31.75,53.08 32.38,53.72 33.91,53.72 v36.58,51.05 | v25.53,57.53 25.53,53.96 24.41,52.84 23.14,52.84 C_LT/1.2
  Bottom 1.016: C3V3.2 80.77,78.53 80.77,84.2 | v65.15,81.5 67.06,81.5 CIN.2 | C5V.2 78.87,84.2 | R2_3V3.1 84.45,75.31 v85.34,76.58 | v87.25,69.85 CNR.2 | R2_5V.1 70.4,76.54 69.72,76.58 66.29,76.58 v65.53,77.34 | 80.77,84.2 78.87,84.2 | 78.87,84.2 78.87,85.72 78.49,86.11 67.44,86.11 65.15,83.82 v65.15,81.5 | v18.67,80.77 18.67,87.63 20.19,89.15 v20.19,89.28 20.19,93.73 v17.27,95.12 11.05,95.12 9.14,96.39 BBCUR.4 | v80.77,86.11 80.77,84.2 | LCD1.37 57.15,90.3 54.48,87.63 54.48,84.62 C1.2 | 109.22,12.32 108.58,12.95 108.58,14.48 110.87,16.76 v113.16,16.76 | JTAG.4 148.97,34.67 150.11,35.81 v150.11,37.34 | RIGHT_COMM.9 144.65,48.13 141.73,51.05 v140.59,51.05 | v94.49,57.15 v94.49,60.2 | 80.77,84.2 87.63,84.2 89.15,83.31 v89.15,79.25 | C2.2 58.34,81.54 59.79,81.54 60.51,80.82 C3.2 64.48,80.82 v65.15,81.5
  Bottom 1.27: B0_1/B0_1.3 145.16,96.77 142.49,94.11 v132.59,94.11 v132.59,85.72 | 106.05,68.2 109.35,68.2 v112.78,71.63
  other vias: 52.98,80.39 54.45,80.39 77.12,75.06
  pour Bottom: 75.44,75.82 75.44,74.3 80.01,74.3 80.01,75.82
  pour Bottom: 56.18,81.28 49.91,81.28 49.91,79.6 56.18,79.6
  pour Top (rank 3): -0.38,107.06 162.31,107.06 162.31,-6.86 -5.33,-6.86 -5.33,107.06
  pour Bottom: -5.33,107.06 162.31,107.06 162.31,-6.86 -5.33,-6.86
GND2  (via drill 0.38, 1.09)
  Top 0.254: v144.02,52.2 144.02,54.23 RIGHT_COMM.3 | v118.11,64.01 118.87,64.01 120.78,62.1 120.78,59.05 124.59,55.24 125.86,55.24 | v139.06,53.34 139.06,51.82 138.3,51.05 v134.87,51.05
  Top 0.61: 125.82,42.58 125.35,43.05 | U1.20 125.09,54.48 125.86,55.24
  Top 1.016: C_VISO2.2 C_VISO1.2 125.82,42.58 | C_VISO4.2 129.16,55.21 C_VISO3.2 | 125.86,55.24 129.88,55.24 C_VISO3.2 | C_VISO3.2 132.4,55.21 132.59,55.21 134.87,52.92 v134.87,51.05 | v132.46,45.21 132.46,43.69 131.19,42.42 125.98,42.42 125.35,43.05 124.21,43.05 U1.11 121.16,43.05 120.78,43.43 120.78,44.58 121.79,45.59 U1.13 | U1.20 121.54,54.48 120.78,53.72 120.78,52.96 120.78,52.58 | 120.78,52.58 121.41,51.94 U1.18 | U1.16 121.28,49.4 120.78,49.91 120.78,52.58
  Bottom 0.254: v144.02,52.2 143.26,52.2 142.49,52.96 140.59,52.96 140.21,53.34 v139.06,53.34 | v118.11,64.01 51.05,64.01 36.96,49.91 33.15,49.91 30.48,47.24 16.76,47.24 16.38,46.86 12.57,46.86 12.19,47.24 12.19,48.77 11.05,49.91 LEFT_COMM.3
  Bottom 1.016: v132.46,45.21 134.87,47.62 v134.87,51.05
  pour Top: 136.02,56.01 121.54,56.01 121.54,40.01 136.02,40.01
GND_1
  Bottom 0.305: LEFT_TX.7 15.71,55.92 C_LT/2.2 11.52,55.92 10.41,57.02 LEFT_COMM.9
GND_2
  Bottom 0.254: RIGHT_TX1.7 138.3,59.44 138.3,57.15 140.97,57.15 141.35,56.77 142.11,56.01 142.11,54.48 143.38,53.21 RIGHT_COMM.5
  Bottom 0.61: RIGHT_TX1.7 142.53,59.44 C_RT/2.2
GSPI  (via drill 0.38)
  Top 0.254: v29.34,19.81 30.1,19.81 v31.24,18.67 | v32,39.24 32,42.24 HCPL092J-00E.G11
  Top 0.305: HCPL092J-00E.G1 24.51,44.11 24.83,44.43 31.88,44.43 32.12,44.19 HCPL092J-00E.G11
  Bottom 0.254: v29.34,19.81 28.96,20.19 28.96,34.67 29.46,35.18 U$14.2 29.46,37.85 30.48,38.86 31.62,38.86 v32,39.24 | v31.24,18.67 31.24,2.29 30.86,1.91 28.83,1.91 ADC_MCU.12
IP  (via drill 0.38)
  Top 0.254: J_IP.1 5.08,80.77 6.48,80.77 | 6.48,80.77 7.62,80.77 v15.62,80.77 | v16.76,77.34 18.57,76 RP.1 | v6.48,81.79 6.48,80.77
  Bottom 0.254: v15.62,80.77 16.76,80.01 v16.76,77.34 | BBCUR.2 4.32,91.31 5.71,89.92 5.71,82.68 v6.48,81.79
IPF
  Top 0.254: J_IPF.1 21.46,72.26 20.32,73.41 20.32,74.89 RP.2
  Top 0.305: RP.2 CP.1
IS  (via drill 0.38)
  Top 0.254: J_IS.1 2.41,73.03 9.91,73.03 | 9.91,73.03 11.6,73.03 RS.1 | v9.91,74.3 9.91,73.03
  Bottom 0.254: BBCUR.3 3.68,93.85 8,89.53 8,76.2 v9.91,74.3
ISF
  Top 0.305: J_ISF.1 14.82,72.26 RS.2 CS.1
MISO  (via drill 0.46)
  Top 0.254: HCPL092J-00E.OUT4 29.59,40.14 31.24,38.48 31.24,35.81 v30.86,35.43
  Bottom 0.254: v30.86,35.43 29.72,34.29 29.72,29.34 31.62,27.43 31.62,20.19 28.57,17.14 28.57,4.7 ADC_MCU.10
MOSI  (via drill 0.38, 0.46)
  Top 0.254: HCPL092J-00E.IN3 28.33,38.61 28.19,38.48 v28.19,35.43 | v27.43,10.67 27.43,10.29 28.57,9.14 28.57,4.95 28.96,4.57 31.24,4.57 ADC_MCU.8
  Bottom 0.254: v28.19,35.43 28.19,34.29 27.81,33.91 27.81,28.19 27.43,27.81 v27.43,10.67
N$1
  Bottom 0.254: IC1.4 53.22,76.72 52.7,76.2 52.66,76.2 L1.L1
N$2
  Bottom 0.254: IC1.2 54.22,77.1 54.99,76.33 54.99,74.22 L1.L2
N$3
  Top 1.016: R_CAN.2 138.66,41.43 CAN_T.1
N$4
  Top 0.254: C25.1 52.16,39.59 51.82,39.24 45.72,39.24 44.96,38.48 44.96,37.34 44.96,36.58 45.72,35.81 56.01,35.81 56.61,35.21 56.61,34 | U3.23 60.96,34.96 60,34 56.61,34 | 56.61,34 Q1.1 56.53,32.03 55.03,30.53 R3.2
N$5  (via drill 0.38)
  Top 0.254: v56.39,76.96 v56.39,81.92
  Bottom 0.254: R2_FB.2 58.25,84.84 56.52,84.84 54.72,83.04 IC1.10 54.77,81.92 v56.39,81.92 | R1_FB.1 58.29,76.58 56.77,76.58 v56.39,76.96
N$6  (via drill 0.38)
  Top 0.254: v79.63,73.15 v79.63,71.63
  Bottom 0.254: U$1.6 78.85,73.17 78.87,73.15 v79.63,73.15 | v79.63,71.63 80.77,71.63 81.15,71.25 81.15,69.89 CNR.1
N$7
  Bottom 0.254: U$1.7 78.35,72.91 78.49,72.77 78.87,72.39 81.66,72.39 82.04,72.77 82.04,73.15 | 82.04,73.15 R1_3V3.1 | R2_3V3.2 82.13,73.06 82.04,73.15
  Bottom 1.016: R2_3V3.2 86.4,73.06 87.25,73.91 87.25,77.6 86.87,77.98 C3P.2
N$8
  Top 0.254: U3.24 63.42,34.46 62.74,33.78 60.83,33.78 60.58,33.53 57.91,30.86 56.91,29.86 R3.1 56.75,29.84 56.75,28.72 55.03,27 55,27 54,27 53.43,27.57 53.43,28.82 R_OSC.2
N$9
  Top 0.254: C2_BG.1 11.9,62.83 12.83,63.75 U$2.TRIM/NR
N$10  (via drill 1.1)
  Top 1.016: v68.2,74.68 68.2,82.3 70.48,83.44 v72.39,83.44
  Bottom 0.254: 74.33,74.51 74.55,74.3 74.55,71.37 75.82,70.48 76.96,70.48 77.34,70.87 U$1.9
  Bottom 1.016: v68.2,74.68 69.81,74.21 R2_5V.2 70.83,74.3 71.63,74.3 71.84,74.51 R1_5V.1 74.33,74.51 | C1P.2 72.56,83.27 v72.39,83.44
N$11
  Top 0.254: R_BOOT1.2 137.25,101.05 138.3,102.11 141.35,102.11 142.49,100.97 142.49,99.69 B0_1/B0_1.2
N$12
  Top 0.254: C9.2 13.3,9.14 14.48,9.14 15.24,9.14 16.13,10.03 16.13,11.26 R_RST1.1 R_RST2.2 18.29,11.26
  Top 1.016: RESET.P$1 13.78,7.24 12.6,8.42 12.6,9.84 C9.2
N$13
  Top 1.016: RGL.1 LED.A
N$14
  Top 0.254: 46.99,40.35 C26.1 45.34,40.39 44.2,39.24 44.2,35.43 45.63,34 47.11,34 | R_OSC.1 51.73,33.27 51,34 47.11,34 | 47.11,34 Q1.2
N$15
  Top 1.27: BAL_MOS.D 121,73.03 117.89,76.13 117.89,77.93 R_BAL.2
N$16
  Top 0.254: VOM_1271.4 124.69,71.31 BAL_MOS.G
N$17
  Top 0.254: U3.71 83.81,23.07 C23.2
N$18
  Top 0.254: RY.1 115.02,19.63 U$3.A
N$19
  Top 0.305: HCPL092J-00E.IN4 29.59,50.54 31.24,52.2 31.24,59.82 29.34,61.72 27.43,61.72 26.61,60.9 U$8.12
N$21  (via drill 0.38)
  Top 0.254: HCPL092J-00E.OUT3 28.33,49.66 v28.57,49.91 | v27.81,57.53 27.81,60.05 U$8.14
  Bottom 0.254: v28.57,49.91 28.57,51.05 28.19,51.44
  Bottom 0.305: 28.19,51.44 28.19,54.86 27.81,55.24 v27.81,57.53
N$22
  Top 0.305: HCPL092J-00E.OUT2 27.05,49.53 28.19,51.82 28.19,54.48 29.72,55.63 29.72,57.91 28.51,59.12 U$8.15
N$23  (via drill 0.38)
  Top 0.305: HCPL092J-00E.OUT1 25.78,51.19 25.53,51.44 25.53,55.63 26.29,56.39 v28.73,56.4 | v30.48,57.15 30.48,59.05 30.1,59.44 29.34,59.44 29.15,59.63 U$8.16
  Bottom 0.305: v28.73,56.4 29.72,56.39 v30.48,57.15
N$24
  Bottom 0.254: C_DISP1.1 97.37,94.07 LCD1.21
N$25
  Top 1.016: RWK1.1 RWK2.2 C29.1 11.94,97.28 10.03,98.42 10.02,98.44 10.02,100.56 10.81,101.35 WKUP.P$2
N$26
  Top 0.254: RR.1 115.02,30.04 U$4.A
N$27  (via drill 0.38)
  Top 0.254: U3.48 72.31,18.21 72.31,17.83 65.15,10.67 64.39,9.91 64.01,9.53 64.01,6.86 64.77,6.1 65.53,6.1 66.29,6.86 66.29,7.24 66.67,7.62 69.34,7.62 v70.1,6.86 | RBOOT2.1 127,2.54 v126.49,3.05
  Bottom 0.254: v126.49,3.05 97.16,3.05 96.01,1.91 95.25,1.91 95,2.16 89.28,2.16 88.77,2.67 72.39,2.67 70.1,4.95 v70.1,6.86
N$28
  Top 0.254: RO.1 115.02,24.71 U$5.A
N$29
  Top 0.254: C24.2 93.89,44.07 92.58,44.07 92.58,46.1 92.2,46.48 88.77,46.48 88.77,46.1 87.63,44.96 U3.106
N$30
  Bottom 0.254: C_DISP1.2 95.67,94.07 LCD1.22
N$31
  Top 0.254: R_BALIN.2 123.44,62.19 VOM_1271.1
N$32
  Bottom 0.254: C_DISP2.2 89.88,94.19 LCD1.24
N$33  (via drill 1.09)
  Top 1.016: LED1.2 58.42,66.55 v59.82,65.15 | v89.53,69.72 97.16,69.72 97.92,68.96 97.92,66.67 LED1.20
  Bottom 1.016: v59.82,65.15 81.53,65.15 83.82,67.44 87.25,67.44 v89.53,69.72
N$34
  Top 0.254: R9.1 69.09,57.78 R10.1 69.22,55.41 C18.2 69.22,55.33 69.22,53.98 68.2,52.96 66.67,52.96 66.29,52.58 66.29,51.05 67.31,50.03 U3.143
N$35
  Top 0.254: B1_1/B1_1.2 140.59,1.14 138.3,1.14 137.79,1.14 137,1.93 RBOOT2.2
N$36
  Top 0.254: 143.64,16.76 143.64,17.53 144.02,17.91 144.21,18.1 144.4,18.29 149.73,18.29 150.5,19.05 150.5,22.48 150.11,22.86 149.73,23.24 146.3,23.24 145.54,24 JTAG.11
  Top 0.61: RM3.3.1 143.02,15.77 143.64,16.38 143.64,17.53 144.21,18.1
  Bottom 0.254: JTAG.11 145.54,24 143.64,22.1 R17.1
N$37
  Top 0.406: RM3.2.1 143.62,14.97 JTAG.17
N$38
  Bottom 0.254: LED1.19 95.25,72.73 R_DISP.2
N$39
  Bottom 0.254: T1.3 98.89,71.12 R_DISP.1
N$40
  Top 0.254: R_TRAN.1 107.57,65.57 T1.2
PA0/USART4_TX_LEFT  (via drill 0.38)
  Top 0.254: v67.06,33.15 68.2,33.15 68.2,31.62 66.04,29.46 U3.34 | v35.05,47.24 v35.05,54.1
  Bottom 0.254: LEFT_TX.2 22.1,56.01 24.77,58.67 30.86,58.67 34.29,54.86 v35.05,54.1 | v67.06,33.15 65.15,33.15 63.25,31.24 58.29,31.24 57.53,30.48 53.72,30.48 52.96,29.72 42.29,29.72 34.67,37.34 34.67,46.86 v35.05,47.24
PA0/USART4_TX_LEFT_O/P
  Bottom 0.305: LEFT_COMM.7 11.81,54.99 12.06,54.74 LEFT_TX.6
PA1/USART4_RX_LEFT  (via drill 0.38)
  Top 0.254: U3.35 64.39,28.96 66.29,28.96 68.96,31.62 68.96,35.05 v67.82,35.05 | v35.43,44.96 34.29,44.96 v33.53,44.96
  Bottom 0.254: v35.43,44.96 35.43,37.72 36.96,36.2 39.24,33.91 40.39,32.77 42.67,30.48 43.05,30.48 52.58,30.48 53.34,31.24 56.77,31.24 57.53,32 61.72,32 62.48,32 63.25,32.77 64.39,33.91 66.29,33.91 67.44,35.05 v67.82,35.05 | v33.53,44.96 17.53,44.96 17.14,44.58 7.24,44.58 6.1,45.72 6.1,50.67 LEFT_COMM.6
PA2/USART2_TX  (via drill 0.38)
  Top 0.254: 70.48,35.81 70.87,36.2 | 70.87,36.2 73.91,39.24 75.44,40.77 78.11,40.77 78.49,41.15 v78.49,41.53 | v81.92,41.53 v81.92,43.81 | v85.72,64.77 v85.72,61.72 | U3.36 66.56,28.46 69.72,31.62 69.72,35.05 70.87,36.2
  Bottom 0.254: v78.49,41.53 v81.92,41.53 | v85.72,64.77 101.35,64.77 116.59,64.77 120.4,68.58 UEXT1.3 | v85.72,61.72 85.72,52.58 85.72,49.53 83.82,47.62 82.3,46.1 82.3,44.58 82.3,44.2 v81.92,43.81
PA3/USART2_RX  (via drill 0.38)
  Top 0.254: v78.87,40.39 78.49,40.01 78.11,40.01 75.82,40.01 71.25,35.43 70.48,34.67 70.48,31.62 66.67,27.81 65.53,27.81 65.15,27.43 65.15,25.91 65.91,25.15 66.67,25.15 66.81,25.29 U3.37 | v83.06,41.53 v83.06,43.81 | v86.87,65.53 v86.87,61.72
  Bottom 0.254: v78.87,40.39 82.3,40.39 83.06,41.15 v83.06,41.53 | v83.06,43.81 83.06,46.1 86.49,49.53 86.49,52.58 86.49,60.58 86.87,60.96 v86.87,61.72 | v86.87,65.53 101.73,65.53 116.2,65.53 119.63,68.96 119.63,88.39 116.2,91.82 116.2,97.16 116.2,98.68 116.97,99.44 118.87,99.44 UEXT1.4
PA4/SPI1_NSS
  Top 0.254: U3.40 68.31,21.83 57.15,10.67 48.77,10.67 37.34,10.67 35.05,8.38 ADC_MCU.5
PA5/SPI1_SCK
  Top 0.254: U3.41 68.81,24.24 68.81,21.57 57.15,9.91 48.01,9.91 39.12,9.91 37.59,8.38 ADC_MCU.3
PA6/SPI1_MISO  (via drill 0.38)
  Top 0.254: U3.42 69.31,21.18 66.67,18.54 57.28,9.14 47.24,9.14 v44.96,9.14 | v43.43,12.57 32.13,12.57 29.97,9.65 ADC_MCU.9
  Bottom 0.254: v44.96,9.14 44.96,11.05 v43.43,12.57
PA7/SPI1_MOSI  (via drill 0.38)
  Top 0.254: U3.43 69.81,20.67 67.06,17.91 57.53,8.38 45.72,8.38 v43.43,8.38 | v41.78,11.68 33.91,11.68 32.51,9.91 ADC_MCU.7
  Bottom 0.254: v43.43,8.38 43.43,9.91 v41.78,11.68
PA8  (via drill 0.38)
  Top 0.254: U3.100 91.01,41.96 v91.44,41.53 | v104.78,38.86 104.78,42.67 103.25,44.2 v103.25,47.12 | 100.58,55.24 DS2401.DATA 101.35,55.24 101.73,54.86 101.73,53.34 102.11,52.96 102.87,52.96 103.25,52.58 v103.25,52.2 104.78,52.2 105.54,52.96 R_PP.2
  Bottom 0.254: v104.78,38.86 103.63,37.72 98.3,37.72 98.3,38.86 97.54,39.62 97.54,40.77 96.27,42.04 96.27,42.67 95.76,43.18 92.2,43.18 91.82,42.8 91.82,41.91 v91.44,41.53 | v103.25,47.12 v103.25,52.2
PA9/USART1_TX_RIGHT  (via drill 0.38)
  Top 0.254: U3.101 88.18,42.46 88.39,42.67 88.65,42.93 90.55,42.93 93.22,41.4 95,41.4 95.25,41.4 97.03,41.4 97.66,40.77 97.66,39.88 97.92,39.62 v98.68,39.62 | v102.11,47.12 102.11,44.2 103.25,43.05 104.01,42.29 104.01,39.24 103.63,38.86 v103.12,38.86
  Bottom 0.254: RIGHT_TX1.2 105.54,59.44 103.63,57.53 102.49,56.39 102.49,48.77 102.11,48.39 v102.11,47.12 | v98.68,39.62 98.68,39.24 99.44,38.48 102.74,38.48 v103.12,38.86
PA9/USART1_TX_RIGHT_O/P
  Bottom 0.254: RIGHT_COMM.6 148.21,53.34 149.35,53.34 149.73,53.72 149.73,59.44 148.59,60.58 140.03,60.58 RIGHT_TX1.6
PA10/USART1_RX_RIGHT  (via drill 0.38)
  Top 0.254: RIGHT_COMM.7 144.02,50.67 144.02,39.62 144.02,38.1 141.73,35.81 139.83,33.91 v139.45,33.53 | U3.102 87.92,42.96 88.52,43.56 90.68,43.56 91.53,43.09 93.6,41.91 95.63,41.91 97.54,41.91 v98.68,40.77